# EAGLE design BPv4-LCDv3 (EAGLE 5.09)
J12: A:16; J23: *A:15
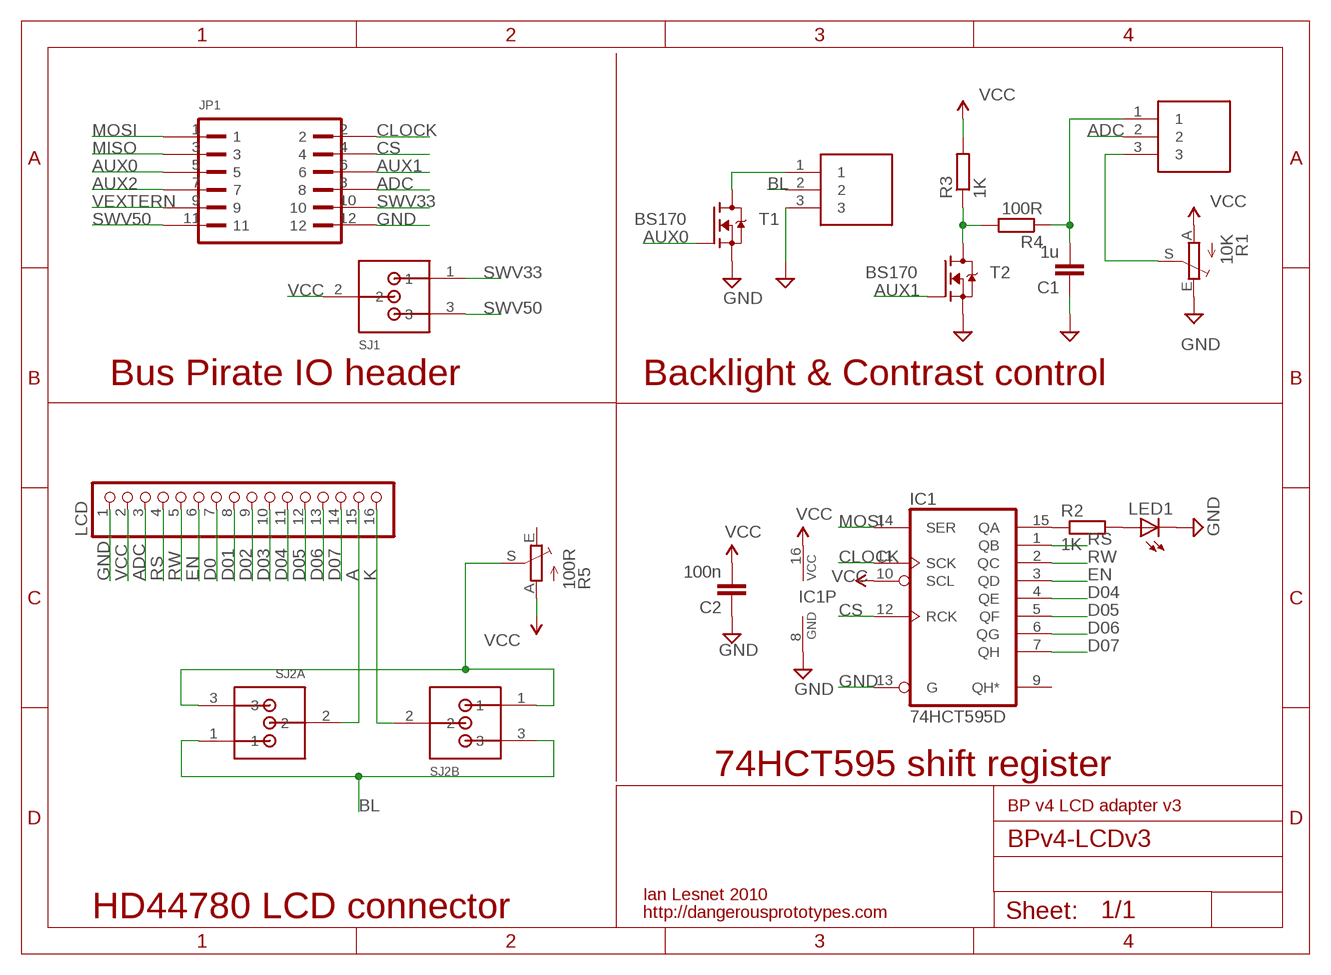
[diagram p0: schematic, sheet 1]

## Parts
C1  1u  CAPC603  [C603]
C2  100n  CAPC603  [C603]
IC1  74HCT595D  74HC595D  [SO16]
J1  HEADER1X3PTH  [M1X3]
J2  HEADER1X3PTH  [M1X3]
JP1  PINSHRD-PTH-2X06  [PINSHRD_PTH_2X06]
LCD  PINHD-1X16  [1X16]
LED1  LEDCHIP-LED0805  [CHIP-LED0805]
R1  10K  TRIM_EU-CA6V  [CA6V]
R2  1K  RESISTORR603  [R603]
R3  1K  RESISTORR603  [R603]
R4  100R  RESISTORR603  [R603]
R5  100R  TRIM_EU-CA6V  [CA6V]
SJ1  JUMP3S  [JUMP_SOLDER]
SJ2A  JUMP3S  [JUMP_SOLDER]
SJ2B  JUMP3S  [JUMP_SOLDER]
T1  BS170  [SOT23]
T2  BS170  [SOT23]

## Nets
A: LCD.15 SJ2A.2
ADC: J2.2 JP1.8 LCD.3
AUX0: JP1.5 T1.1(G)
AUX1: JP1.6 T2.1(G)
AUX2: JP1.7
BL: J1.2 SJ2A.1 SJ2B.3
CLOCK: IC1.11(SCK) JP1.2
CS: IC1.12(RCK) JP1.4
D0: LCD.7
D01: LCD.8
D02: LCD.9
D03: LCD.10
D04: IC1.4(QE) LCD.11
D05: IC1.5(QF) LCD.12
D06: IC1.6(QG) LCD.13
D07: IC1.7(QH) LCD.14
EN: IC1.3(QD) LCD.6
GND: C1.1 C2.1 IC1.8(GND) IC1.13(G) J1.3 JP1.12 LCD.1 LED1.C R1.E T1.2(S) T2.2(S)
K: LCD.16 SJ2B.2
MISO: JP1.3
MOSI: IC1.14(SER) JP1.1
N$1: LED1.A R2.2
N$2: IC1.15(QA) R2.1
N$3: C1.2 J2.1 R4.1
N$4: R3.1 R4.2 T2.3(D)
N$5: R5.S SJ2A.3 SJ2B.1
N$6: J1.1 T1.3(D)
N$7: J2.3 R1.S
RS: IC1.1(QB) LCD.4
RW: IC1.2(QC) LCD.5
SWV33: JP1.10 SJ1.1
SWV50: JP1.11 SJ1.3
VCC: C2.2 IC1.10(SCL) IC1.16(VCC) LCD.2 R1.A R3.2 R5.A SJ1.2
VEXTERN: JP1.9
Unconnected: IC1.9(QH*) R5.E

## Notes on the sheet
- Bus Pirate IO header | Backlight & Contrast control
- 74HCT595 shift register
- BP v4 LCD adapter v3
- Ian Lesnet 2010
- HD44780 LCD connector | http://dangerousprototypes.com

## Library data of the parts
C1 C2 = dp_devices:CAP
IC1 = 74xx-eu:74*595: 8-bit SHIFT REGISTER, output latch
J1 J2 = dp_devices:HEADER1X3
JP1 = dp_devices:PINSHRD-PTH-2X06: Shrouded pin header, 2.54mm pitch
LCD = pinhead:PINHD-1X16: PIN HEADER
LED1 = led:LED: LED OSRAM: - CHIPLED LG R971, LG N971, LY N971, LG Q971, LY Q971, LO R971, LY R971 LH N974, LH R974 LS Q976, LO Q976, LY Q976 LO Q996 - Hyper CHIPLED LW Q18S LB Q993, LB Q99A, LB R99A - SideLED LS A670, LO A670, LY A670, LG A670, LP A670 LB A673, LV A673, LT A673, LW A673 LH A674 LY A675 LS A676, LA A676, LO A676, LY A676, LW A676 LS A679, LY A679, LG A679 - Hyper Micro SIDELED® LS Y876, LA Y876, LO Y876, LY Y876 LT Y87S - SmartLED LW L88C, LW L88S LB L89C, LB L89S, LG L890 LS L89K, LO L89K, LY L89K LS L896, LA L896, LO L896, LY L896 - TOPLED LS T670, LO T670, LY T670, LG T670, LP T670 LSG T670, LSP T670, LSY T670, LOP T670, LYG T670 LG T671, LOG T671, LSG T671 LB T673, LV T673, LT T673, LW T673 LH T674 LS T676, LA T676, LO T676, LY T676, LB T676, LH T676, LSB T676, LW T676 LB T67C, LV T67C, LT T67C, LS T67K, LO T67K, LY T67K, LW E67C LS E67B, LA E67B, LO E67B, LY E67B, LB E67C, LV E67C, LT E67C LW T67C LS T679, LY T679, LG T679 LS T770, LO T770, LY T770, LG T770, LP T770 LB T773, LV T773, LT T773, LW T773 LH T774 LS E675, LA E675, LY E675, LS T675 LS T776, LA T776, LO T776, LY T776, LB T776 LHGB T686 LT T68C, LB T68C - Hyper Mini TOPLED® LB M676 - Mini TOPLED Santana® LG M470 LS M47K, LO M47K, LY M47K Source: http://www.osram.convergy.de LUXEON: - LUMILED® LXK2-PW12-R00, LXK2-PW12-S00, LXK2-PW14-U00, LXK2-PW14-V00 LXK2-PM12-R00, LXK2-PM12-S00, LXK2-PM14-U00 LXK2-PE12-Q00, LXK2-PE12-R00, LXK2-PE12-S00, LXK2-PE14-T00, LXK2-PE14-U00 LXK2-PB12-K00, LXK2-PB12-L00, LXK2-PB12-M00, LXK2-PB14-N00, LXK2-PB14-P00, LXK2-PB14-Q00 LXK2-PR12-L00, LXK2-PR12-M00, LXK2-PR14-Q00, LXK2-PR14-R00 LXK2-PD12-Q00, LXK2-PD12-R00, LXK2-PD12-S00 LXK2-PH12-R00, LXK2-PH12-S00 LXK2-PL12-P00, LXK2-PL12-Q00, LXK2-PL12-R00 Source: www.luxeon.com KINGBRIGHT: KA-3528ASYC Source: www.kingbright.com
R1 R5 = pot:TRIM_EU-: POTENTIOMETER
R2-R4 = dp_devices:RESISTOR
SJ1 SJ2A SJ2B = dp_devices:JUMP3; J12: optA; J23: optB
T1 T2 = dp_devices:BS170: N-Channel Enhancement Mode Field Effect Transistor

## Board
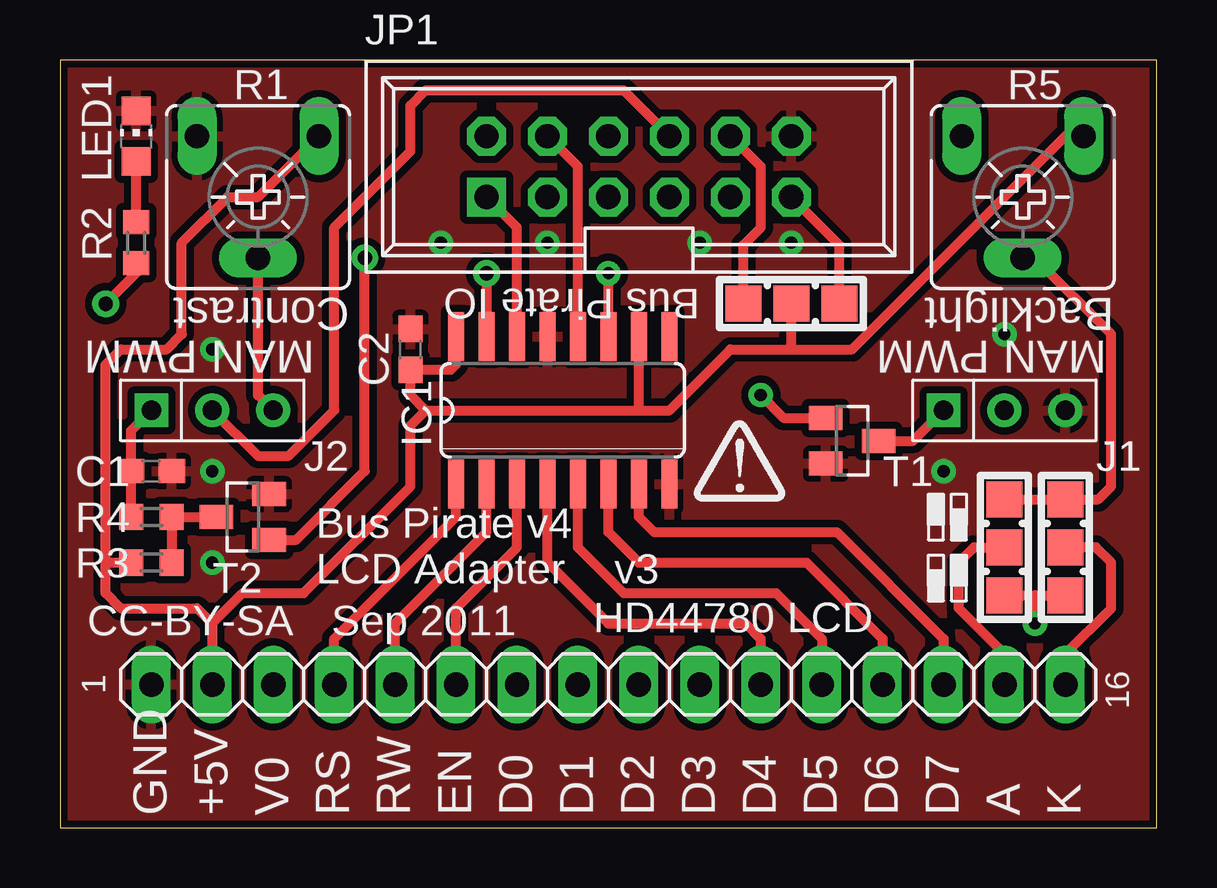
[diagram p1: board, top side]
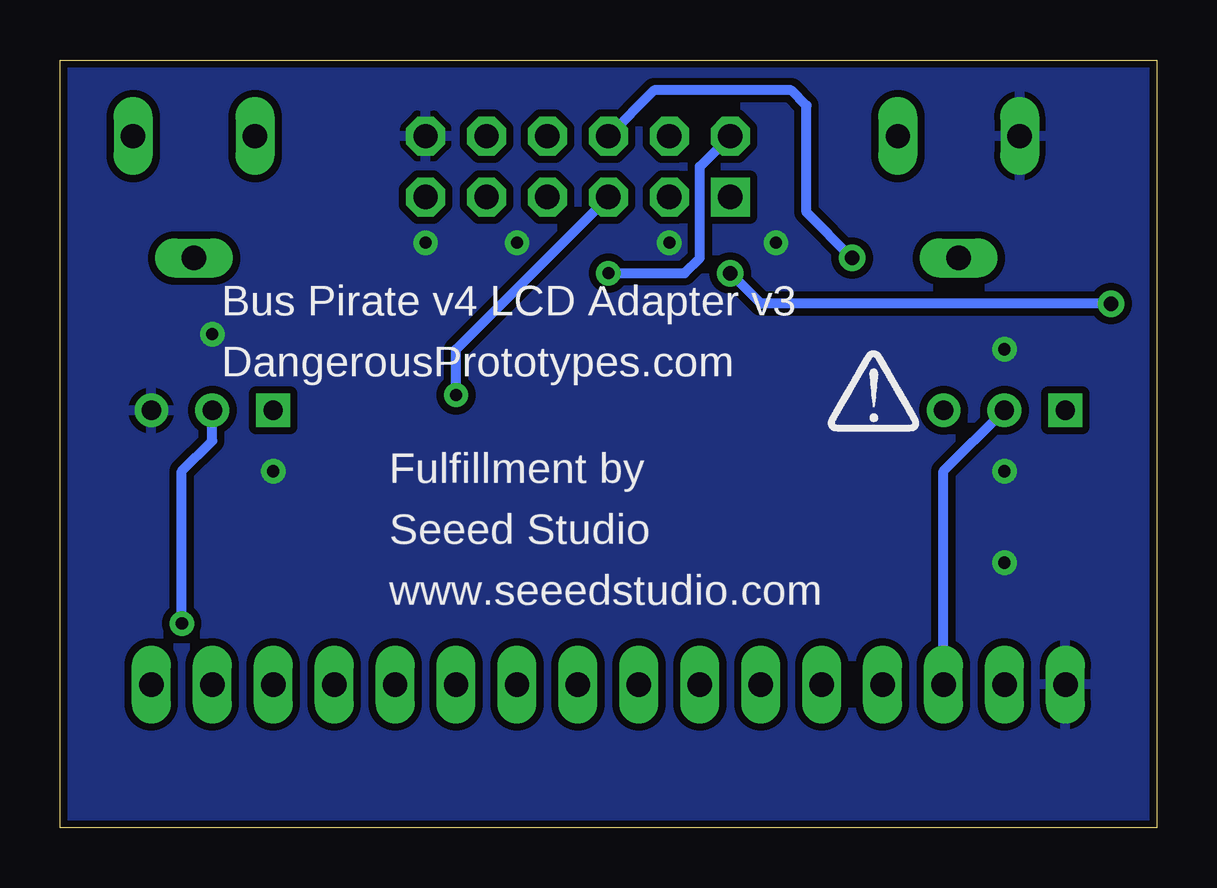
[diagram p2: board, bottom side, seen from below]

Size 45.72 x 32 mm. Coordinates in mm from the lower left corner, seen from the top.
Outline: 0,0 45.72,0 45.72,32 0,32 0,0
Copper layers (1*16): Top 0.035mm / dielectric 1.5mm / Bottom 0.035mm
Design rules "SparkFun": minimum track width 8mil, minimum drill 20mil, track to track 8mil, track to pad 8mil, pad to pad 8mil, via to via 8mil, smd to smd 8mil, copper to edge 10mil, drill to drill 8mil, minimum pad ring 12mil, minimum via ring 10mil, stop-mask expansion 4mil, vias tented up to drill 25mil, thermal gap 10mil

### Footprints (pad centres in the part's own frame; a part is rotated, then mirrored left to right if it is on the bottom)
C603 = smd 1.1 x 1: 1 -0.85,0; 2 0.85,0
SO16 = smd 0.66 x 2.032: 1 -4.445,-3.073; 2 -3.175,-3.073; 3 -1.905,-3.073; 4 -0.635,-3.073; 5 0.635,-3.073; 6 1.905,-3.073; 7 3.175,-3.073; 8 4.445,-3.073; 9 4.445,3.073; 10 3.175,3.073; 11 1.905,3.073; 12 0.635,3.073; 13 -0.635,3.073; 14 -1.905,3.073; 15 -3.175,3.073; 16 -4.445,3.073
M1X3 = drill 0.8 square: 1 0,0 | drill 0.8 round: 2 2.54,0; 3 5.08,0
PINSHRD_PTH_2X06 = drill 1.016 square: 1 -6.35,-1.27 | drill 1.016 octagon: 2 -6.35,1.27; 3 -3.81,-1.27; 4 -3.81,1.27; 5 -1.27,-1.27; 6 -1.27,1.27; 7 1.27,-1.27; 8 1.27,1.27; 9 3.81,-1.27; 10 3.81,1.27; 11 6.35,-1.27; 12 6.35,1.27
1X16 = drill 1.016 long: 1 -19.05,0; 2 -16.51,0; 3 -13.97,0; 4 -11.43,0; 5 -8.89,0; 6 -6.35,0; 7 -3.81,0; 8 -1.27,0; 9 1.27,0; 10 3.81,0; 11 6.35,0; 12 8.89,0; 13 11.43,0; 14 13.97,0; 15 16.51,0; 16 19.05,0
CHIP-LED0805 = smd 1.2 x 1.2: A 0,-1.05; C 0,1.05
CA6V = drill 1.016 long: A -2.54,-2.54; E 2.54,-2.54; S 0,2.54
R603 = smd 1 x 1.1: 1 -0.85,0; 2 0.85,0
JP3_0805 = smd 1.5 x 1.5: 1 -2,0; 2 0,0; 3 2,0
SOT23 = smd 1 x 1.4: 1 -0.95,-1.1; 2 0.95,-1.1; 3 0,1.1

### Placement (x,y rotation side)
C1  3.81,14.86 180 top
C2  14.6,19.94 270 top
IC1  20.95,17.4 0 top
J1  36.83,17.4 0 top
J2  3.81,17.4 0 top
JP1  24.13,27.56 0 top
LCD  22.86,5.97 0 top
LED1  3.18,28.83 0 top
R1  8.26,26.29 180 top
R2  3.18,24.38 90 top
R3  3.81,11.05 180 top
R4  3.81,12.95 0 top
R5  40.13,26.29 180 top
SJ1  JUMP3  [JP3_0805]  30.48,21.84 0 top
SJ2A  JUMP3  [JP3_0805]  39.37,11.68 90 top
SJ2B  JUMP3  [JP3_0805]  41.91,11.68 270 top
T1  33.02,16.13 270 top
T2  7.62,12.95 90 top
U$1  [DP_LOGO]  28.32,14.22 0 top
U$2  [DP_LOGO]  11.81,17.14 0 bottom

### Tracks (layer width: path | path; a pad name or v marks a point on that pad's centre or on a via)
A
  Top 0.406: LCD.15 39.37,7.24 37.46,9.14 37.46,11.05 38.1,11.68 SJ2A.2
ADC
  Top 0.406: J2.2 8.26,15.49 9.53,15.49 11.43,17.4 11.43,25.02 14.6,28.19 14.6,30.1 15.24,30.73 23.49,30.73 JP1.8
  Bottom 0.406: J2.2 8.89,14.86 LCD.3
AUX0  (via drill 0.51)
  Top 0.406: T1.1 30.16,17.08 v29.21,18.03
  Bottom 0.406: JP1.5 29.21,19.94 v29.21,18.03
AUX1  (via drill 0.6)
  Top 0.406: T2.1 9.85,12 12.7,14.86 v12.7,23.75
  Bottom 0.406: v12.7,23.75 14.6,25.65 14.6,30.1 15.24,30.73 20.95,30.73 JP1.6
BL  (via drill 0.51)
  Top 0.406: SJ2A.1 40.64,9.68 | 40.64,9.68 SJ2B.3 | 40.64,9.68 v40.64,8.51
  Bottom 0.406: v40.64,8.51 40.64,14.86 39.37,16.13 J1.2
CLOCK  (via drill 0.51)
  Top 0.406: IC1.11 v22.86,23.11
  Bottom 0.406: v22.86,23.11 19.69,23.11 19.05,23.75 19.05,27.56 JP1.2
CS
  Top 0.406: IC1.12 21.59,27.56 JP1.4
D04
  Top 0.406: IC1.4 20.32,11.05 22.86,8.51 28.57,8.51 29.2,7.88 29.21,7.24 LCD.11
D05
  Top 0.406: 31.74,7.24 31.74,6.6 31.75,6.61 | IC1.5 21.59,11.68 23.49,9.78 29.84,9.78 31.75,7.87 31.75,6.61 | 31.75,6.61 LCD.12
D06
  Top 0.406: IC1.6 22.86,12.32 24.13,11.05 31.12,11.05 34.29,7.87 LCD.13
D07
  Top 0.406: IC1.7 24.13,12.95 24.77,12.32 32.38,12.32 36.83,7.87 LCD.14
EN
  Top 0.406: IC1.3 19.05,11.68 16.51,9.14 LCD.6
GND  (via drill 0.51)
  other vias: 26.67,24.38 6.35,19.94 20.32,24.38 36.83,14.86 15.88,24.38 6.35,14.86 6.35,11.05 39.37,20.57 30.48,24.38
  pour Bottom (isolate 0.305): 0,32 45.72,32 45.72,0 0,0
  pour Top (isolate 0.305): 0,32 45.72,32 45.72,0 0,0
K
  Top 0.406: LCD.16 41.91,7.24 43.81,9.14 43.81,11.05 43.18,11.68 SJ2B.2
MOSI
  Top 0.406: JP1.1 19.05,25.02 IC1.14
N$1
  Top 0.406: R2.2 LED1.A
N$2  (via drill 0.6)
  Top 0.406: R2.1 3.18,23.11 v1.91,21.84 | v17.78,23.11 IC1.15
  Bottom 0.406: v1.91,21.84 16.51,21.84 v17.78,23.11
N$3
  Top 0.406: R4.1 C1.2 2.96,16.55 J2.1
N$4
  Top 0.406: R3.1 R4.2 T2.3
N$5
  Top 0.406: R5.S 40.64,23.75 43.81,20.57 43.81,14.22 43.27,13.68 SJ2B.1 SJ2A.3
N$6
  Top 0.406: T1.3 35.56,16.13 36.2,16.76 J1.1
N$7
  Top 0.406: J2.3 8.26,18.03 R1.S
RS
  Top 0.406: LCD.4 11.43,7.87 16.51,12.95 IC1.1
RW
  Top 0.406: IC1.2 17.78,12.32 13.97,8.51 LCD.5
SWV33
  Top 0.406: JP1.10 29.21,27.56 29.21,25.02 28.48,24.29 SJ1.1
SWV50
  Top 0.406: SJ1.3 32.48,24.29 JP1.11
VCC
  Top 0.406: R1.A 8.26,26.29 6.99,26.29 5.08,24.38 5.08,20.57 4.45,19.94 2.54,19.94 1.91,19.3 1.91,11.05 | 24.13,17.4 IC1.10 | 24.13,17.4 25.4,17.4 27.94,19.94 30.48,19.94 | 30.48,19.94 33.02,19.94 41.91,28.83 R5.A | 15.24,17.4 24.13,17.4 | 1.91,11.05 1.91,9.78 2.54,9.14 5.71,9.14 6.35,8.51 | 6.35,8.51 LCD.2 | 1.91,11.05 R3.2 | IC1.16 16.51,20.57 | 30.48,19.94 SJ1.2 | 6.35,8.51 7.62,9.78 10.16,9.78 14.6,14.22 14.6,16.76 15.24,17.4 | 15.24,17.4 14.6,18.03 C2.2 16.3,19.09 16.51,19.3 IC1.16 | IC1.16 16.4,20.36

### Text on the board
tNames: Bus Pirate IO | Contrast | Backlight | MAN PWM | MAN PWM | Bus Pirate v4 | LCD Adapter | v3 | CC-BY-SA | Sep 2011 | HD44780 LCD | 1 | 16 | GND | +5V | V0 | RS | RW | EN | D0 | D1 | D2 | D3 | D4 | D5 | D6 | D7 | A | K
bNames: Bus Pirate v4 LCD Adapter v3 | DangerousPrototypes.com | Fulfillment by | Seeed Studio | www.seeedstudio.com